# Altium schematic sheet 04_ComputerConnect.SchDoc
size A4
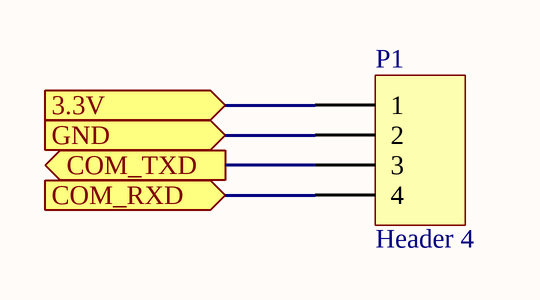
[diagram p0: 04_ComputerConnect.SchDoc]

## Parts
P1  Header 4  [HDR1X4]

## Ports
3.3V (in), COM_RXD (in), COM_TXD (out), GND (in)

## Nets
3.3V: P1.1 ; port 3.3V
COM_RXD: P1.4 ; port COM_RXD
COM_TXD: P1.3 ; port COM_TXD
GND: P1.2 ; port GND

## Notes on the sheet
- Project:
- MANDevices
- Page Contents:
- Size:
- Date:
- A4
- Checked by:
- Time:
- Revision:
- Sheet
- of
- HaNoi University of
- Science and Technology
- File:

## Library data of the parts
P1 = Header 4: Header, 4-Pin; LatestRevisionDate: 17-Jul-2002; LatestRevisionNote: Re-released for DXP Platform.; Publisher: Altium Limited